# EAGLE design development (EAGLE 6.3)
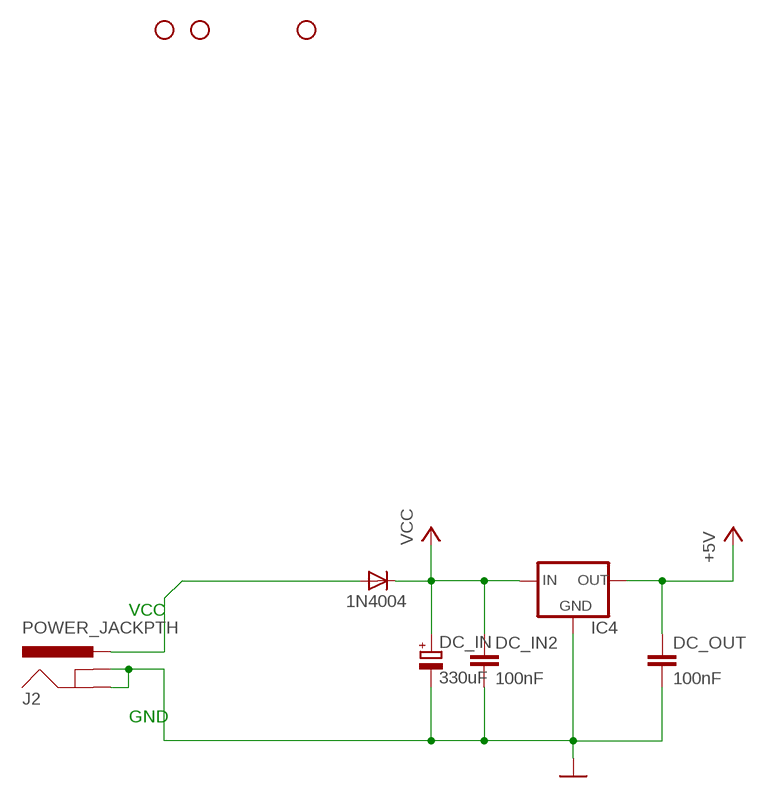
[diagram p0: schematic, sheet 1, part 1 of 2]
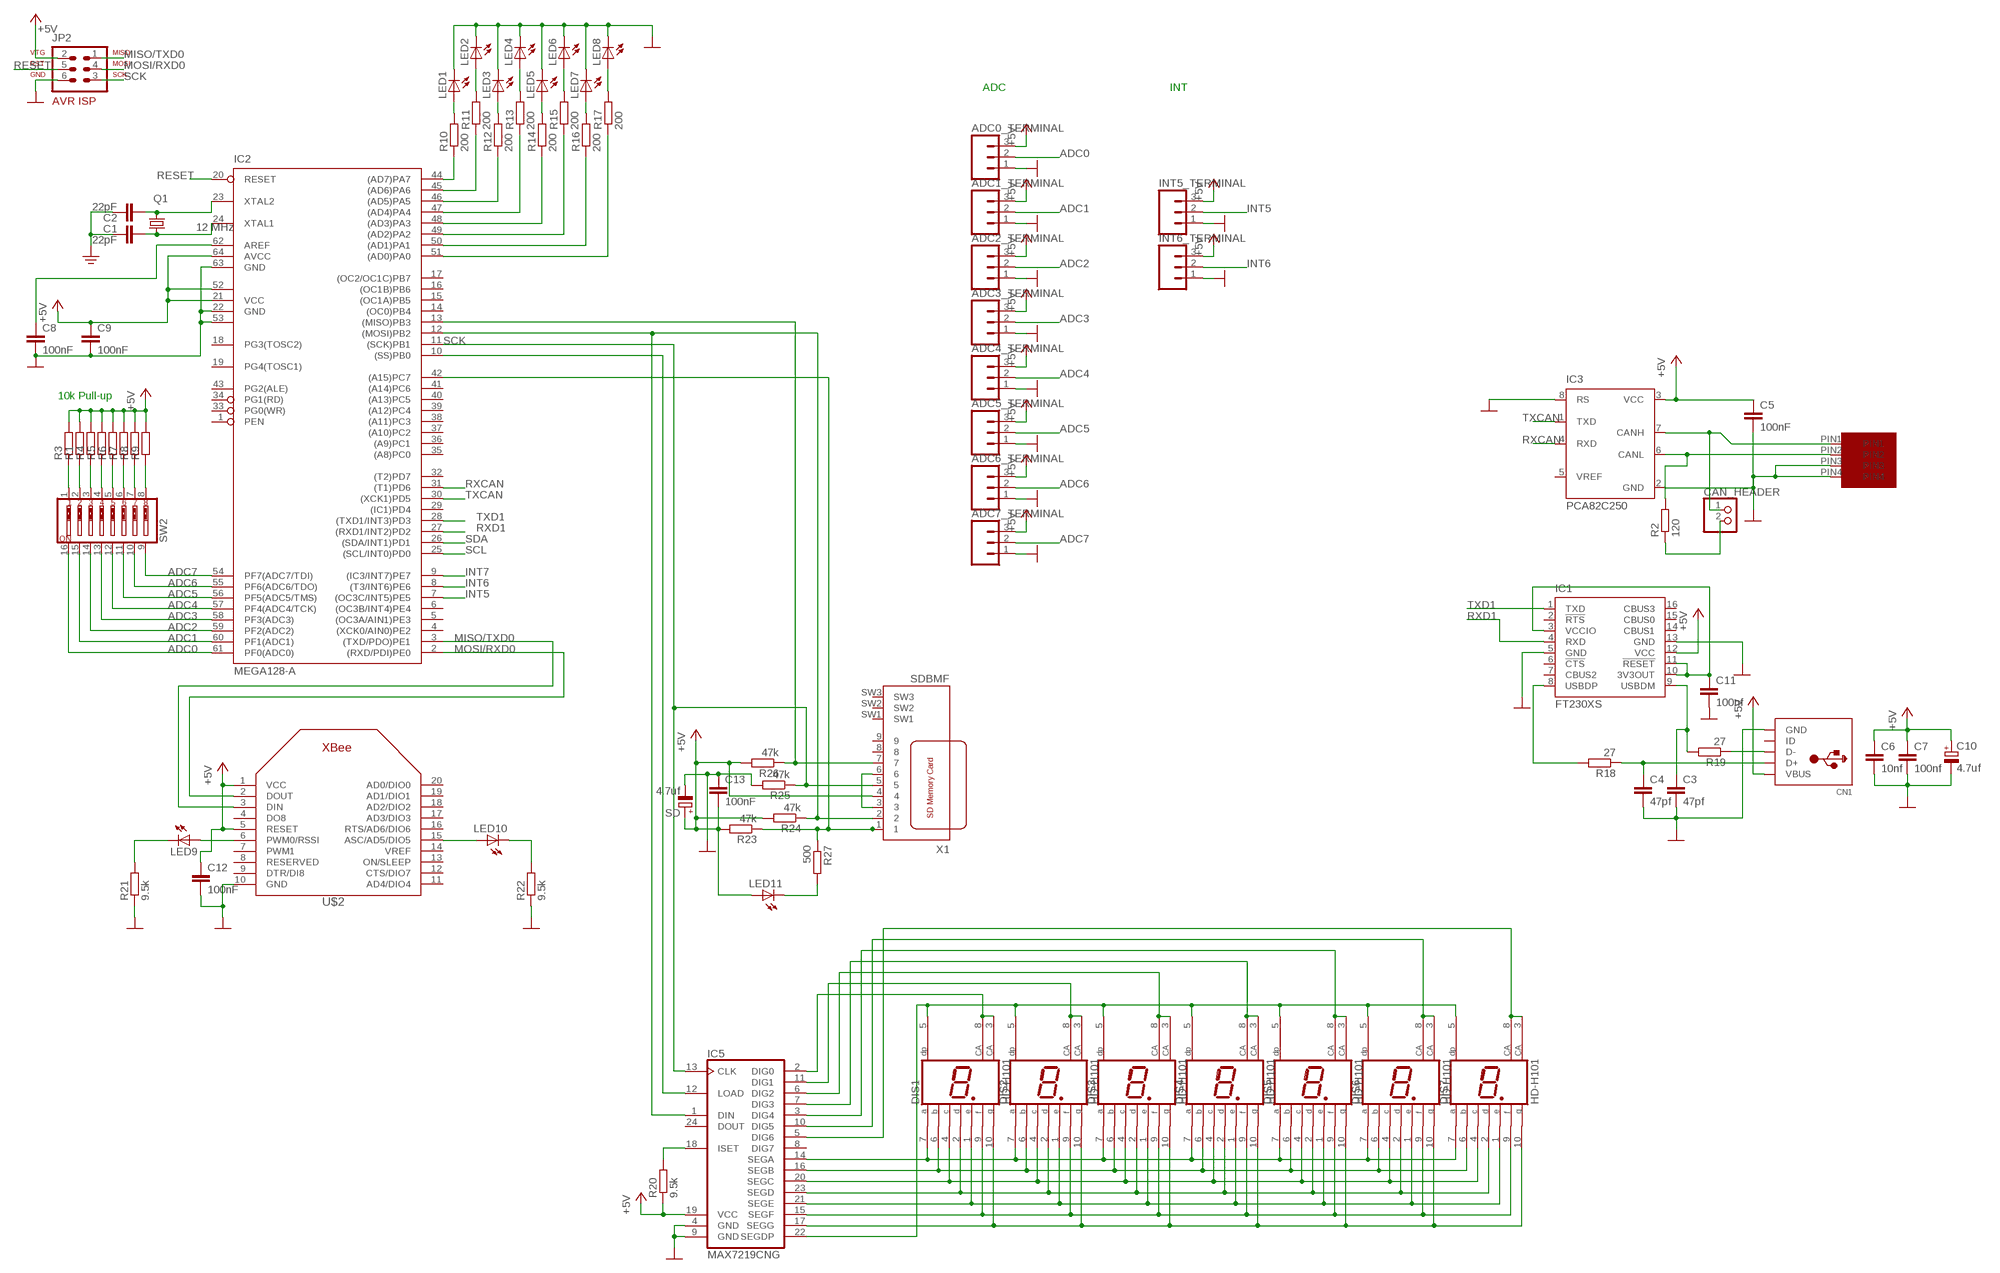
[diagram p1: schematic, sheet 1, part 2 of 2]

## Parts
ADC0_TERMINAL  M03SCREW  [SCREWTERMINAL-3.5MM-3]
ADC1_TERMINAL  M03SCREW  [SCREWTERMINAL-3.5MM-3]
ADC2_TERMINAL  M03SCREW  [SCREWTERMINAL-3.5MM-3]
ADC3_TERMINAL  M03SCREW  [SCREWTERMINAL-3.5MM-3]
ADC4_TERMINAL  M03SCREW  [SCREWTERMINAL-3.5MM-3]
ADC5_TERMINAL  M03SCREW  [SCREWTERMINAL-3.5MM-3]
ADC6_TERMINAL  M03SCREW  [SCREWTERMINAL-3.5MM-3]
ADC7_TERMINAL  M03SCREW  [SCREWTERMINAL-3.5MM-3]
C1  22pF  C5/2.5  [C5B2.5]
C2  22pF  C5/2.5  [C5B2.5]
C3  47pf  C-EU050-025X075  [C050-025X075]
C4  47pf  C-EU050-025X075  [C050-025X075]
C5  100nF  C-EU050-024X044  [C050-024X044]
C6  10nf  C-EU050-025X075  [C050-025X075]
C7  100nf  C-EU050-025X075  [C050-025X075]
C8  100nF  C-EU050-024X044  [C050-024X044]
C9  100nF  C-EU050-024X044  [C050-024X044]
C10  4.7uf  CPOL-EUE2.5-7  [E2,5-7]
C11  100nf  C-EU050-025X075  [C050-025X075]
C12  100nF  C-EU050-024X044  [C050-024X044]
C13  100nF  C-EU050-024X044  [C050-024X044]
CAN_HEADER  PINHD-1X2  [1X02]
CN1  USBMINIB  [USB-MINIB]
DC_IN  330uF  CPOL-EUE15-5AXIAL  [E15-5]
DC_IN2  100nF  C-EU050-024X044  [C050-024X044]
DC_OUT  100nF  C-EU050-024X044  [C050-024X044]
DIS1  HD-H101  [HDSP-M]
DIS2  HD-H101  [HDSP-M]
DIS3  HD-H101  [HDSP-M]
DIS4  HD-H101  [HDSP-M]
DIS5  HD-H101  [HDSP-M]
DIS6  HD-H101  [HDSP-M]
DIS7  HD-H101  [HDSP-M]
ENSRET  1N4004  [DO41-10]
IC1  FT230XS  [SSOP16]
IC2  MEGA128-A  [TQFP64]
IC3  PCA82C250  [DIL08]
IC4  V_REG_78XXSIDE  [78XXL]
IC5  MAX7219CNG  [DIL24-3]
INT5_TERMINAL  M03SCREW  [SCREWTERMINAL-3.5MM-3]
INT6_TERMINAL  M03SCREW  [SCREWTERMINAL-3.5MM-3]
J2  POWER_JACKPTH  [POWER_JACK_PTH]
JP2  AVR-ISP-6  [AVR-ISP-6]
JP3  STAND-OFF  [STAND-OFF]
JP4  STAND-OFF  [STAND-OFF]
JP6  STAND-OFF  [STAND-OFF]
LED1  LED3MM  [LED3MM]
LED2  LED3MM  [LED3MM]
LED3  LED3MM  [LED3MM]
LED4  LED3MM  [LED3MM]
LED5  LED3MM  [LED3MM]
LED6  LED3MM  [LED3MM]
LED7  LED3MM  [LED3MM]
LED8  LED3MM  [LED3MM]
LED9  LED5MM  [LED5MM]
LED10  LED5MM  [LED5MM]
LED11  LED5MM  [LED5MM]
Q1  12 MHz  CRYSTALHC49U70  [HC49U70]
R1  R-EU_R0603  [R0603]
R2  120  R-EU_R0603  [R0603]
R3  R-EU_R0603  [R0603]
R4  R-EU_R0603  [R0603]
R5  R-EU_R0603  [R0603]
R6  R-EU_R0603  [R0603]
R7  R-EU_R0603  [R0603]
R8  R-EU_R0603  [R0603]
R9  R-EU_R0603  [R0603]
R10  200  R-EU_R0603  [R0603]
R11  200  R-EU_R0603  [R0603]
R12  200  R-EU_R0603  [R0603]
R13  200  R-EU_R0603  [R0603]
R14  200  R-EU_R0603  [R0603]
R15  200  R-EU_R0603  [R0603]
R16  200  R-EU_R0603  [R0603]
R17  200  R-EU_R0603  [R0603]
R18  27  R-EU_R0603  [R0603]
R19  27  R-EU_R0603  [R0603]
R20  9.5k  R-EU_0204/7  [0204/7]
R21  9.5k  R-EU_0204/7  [0204/7]
R22  9.5k  R-EU_0204/7  [0204/7]
R23  47k  R-EU_0204/7  [0204/7]
R24  47k  R-EU_0204/7  [0204/7]
R25  47k  R-EU_0204/7  [0204/7]
R26  47k  R-EU_0204/7  [0204/7]
R27  500  R-EU_0204/7  [0204/7]
SD  4.7uf  CPOL-EUE15-5AXIAL  [E15-5]
SW2  SW_DIP-8  [DIPSWITCH-08]
U$1  MICROFIT4  [MICROFIT4SOCK]
U$2  XBEE  [XBEE]
X1  SDBMF  [SDBMF-009XXBXX2]

## Nets
+5V: ADC0_TERMINAL.3 ADC1_TERMINAL.3 ADC2_TERMINAL.3 ADC3_TERMINAL.3 ADC4_TERMINAL.3 ADC5_TERMINAL.3 ADC6_TERMINAL.3 ADC7_TERMINAL.3 C5.1 C6.1 C7.1 C9.1 C10.+ C13.2 CN1.VBUS DC_OUT.1 IC1.12(VCC) IC2.21(VCC) IC2.52(VCC1) IC2.64(AVCC) IC3.3(VCC) IC4.OUT IC5.19(VCC) INT5_TERMINAL.3 INT6_TERMINAL.3 JP2.2 LED11.A R1.2 R3.2 R4.2 R5.2 R6.2 R7.2 R8.2 R9.2 R20.1 R23.2 R24.2 R26.2 SD.+ X1.4
ADC0: ADC0_TERMINAL.2 IC2.61(PF0(ADC0)) SW2.16
ADC1: ADC1_TERMINAL.2 IC2.60(PF1(ADC1)) SW2.15
ADC2: ADC2_TERMINAL.2 IC2.59(PF2(ADC2)) SW2.14
ADC3: ADC3_TERMINAL.2 IC2.58(PF3(ADC3)) SW2.13
ADC4: ADC4_TERMINAL.2 IC2.57(PF4(ADC4/TCK)) SW2.12
ADC5: ADC5_TERMINAL.2 IC2.56(PF5(ADC5/TMS)) SW2.11
ADC6: ADC6_TERMINAL.2 IC2.55(PF6(ADC6/TDO)) SW2.10
ADC7: ADC7_TERMINAL.2 IC2.54(PF7(ADC7/TDI)) SW2.9
CANJUMP1: CAN_HEADER.1 IC3.7(CANH) U$1.PIN1
CANJUMP2: CAN_HEADER.2 R2.1
INT5: IC2.7((OC3C/INT5)PE5) INT5_TERMINAL.2
INT6: IC2.8((T3/INT6)PE6) INT6_TERMINAL.2
INT7: IC2.9((IC3/INT7)PE7)
MISO/TXD0: IC2.3((TXD/PDO)PE1) JP2.1 U$2.3(DIN)
MOSI/RXD0: IC2.2((RXD/PDI)PE0) JP2.4 U$2.2(DOUT)
N$1: C1.2 IC2.24(XTAL1) Q1.1
N$2: C2.2 IC2.23(XTAL2) Q1.2
N$3: R1.1 SW2.2
N$4: R3.1 SW2.1
N$5: ENSRET.A J2.PWR
N$6: IC2.44((AD7)PA7) R10.1
N$7: R4.1 SW2.3
N$8: LED1.A R10.2
N$9: IC2.45((AD6)PA6) R11.1
N$10: C8.1 IC2.62(AREF)
N$11: LED2.A R11.2
N$12: IC2.46((AD5)PA5) R12.1
N$13: LED3.A R12.2
N$14: R5.1 SW2.4
N$15: R6.1 SW2.5
N$16: R7.1 SW2.6
N$17: R8.1 SW2.7
N$18: IC2.47((AD4)PA4) R13.1
N$19: LED4.A R13.2
N$20: R9.1 SW2.8
N$21: IC2.48((AD3)PA3) R14.1
N$22: LED5.A R14.2
N$23: IC2.49((AD2)PA2) R15.1
N$24: IC2.50((AD1)PA1) R16.1
N$25: LED6.A R15.2
N$26: LED7.A R16.2
N$27: IC2.51((AD0)PA0) R17.1
N$28: LED8.A R17.2
N$29: C3.1 IC1.9(USBDM) R19.2
N$30: IC1.8(USBDP) R18.2
N$31: C4.1 CN1.D+ R18.1
N$32: CN1.D- R19.1
N$33: DIS1.7(A) DIS2.7(A) DIS3.7(A) DIS4.7(A) DIS5.7(A) DIS6.7(A) DIS7.7(A) IC5.14(SEGA)
N$34: DIS1.6(B) DIS2.6(B) DIS3.6(B) DIS4.6(B) DIS5.6(B) DIS6.6(B) DIS7.6(B) IC5.16(SEGB)
N$35: DIS1.4(C) DIS2.4(C) DIS3.4(C) DIS4.4(C) DIS5.4(C) DIS6.4(C) DIS7.4(C) IC5.20(SEGC)
N$36: C11.1 IC1.3(VCCIO) IC1.10(3V3OUT) IC1.11(!RESET)
N$37: DIS1.2(D) DIS2.2(D) DIS3.2(D) DIS4.2(D) DIS5.2(D) DIS6.2(D) DIS7.2(D) IC5.23(SEGD)
N$38: DIS1.1(E) DIS2.1(E) DIS3.1(E) DIS4.1(E) DIS5.1(E) DIS6.1(E) DIS7.1(E) IC5.21(SEGE)
N$39: DIS1.9(F) DIS2.9(F) DIS3.9(F) DIS4.9(F) DIS5.9(F) DIS6.9(F) DIS7.9(F) IC5.15(SEGF)
N$40: DIS1.10(G) DIS2.10(G) DIS3.10(G) DIS4.10(G) DIS5.10(G) DIS6.10(G) DIS7.10(G) IC5.17(SEGG)
N$41: DIS1.5(DP) DIS2.5(DP) DIS3.5(DP) DIS4.5(DP) DIS5.5(DP) DIS6.5(DP) DIS7.5(DP) IC5.22(SEGDP)
N$42: DIS1.3(CA) DIS1.8(CA) IC5.2(DIG0)
N$43: DIS2.3(CA) DIS2.8(CA) IC5.11(DIG1)
N$44: DIS3.3(CA) DIS3.8(CA) IC5.6(DIG2)
N$45: DIS4.3(CA) DIS4.8(CA) IC5.7(DIG3)
N$46: DIS5.3(CA) DIS5.8(CA) IC5.3(DIG4)
N$47: DIS6.3(CA) DIS6.8(CA) IC5.10(DIG5)
N$48: DIS7.3(CA) DIS7.8(CA) IC5.5(DIG6)
N$49: LED9.K(C) R21.2
N$50: IC5.18(ISET) R20.2
N$51: IC3.6(CANL) R2.2 U$1.PIN2
N$52: LED9.A U$2.6(PWM0/RSSI)
N$53: IC2.10((SS)PB0) IC5.12(LOAD)
N$55: LED10.A U$2.15(ASC/AD5/DIO5)
N$56: LED10.K(C) R22.2
N$57: X1.3 X1.6
N$59: IC2.42((A15)PC7) R23.1 R27.1 X1.1
N$60: IC2.12((MOSI)PB2) IC5.1(DIN) R24.1 X1.2
N$62: IC2.13((MISO)PB3) R26.1 X1.7
N$63: LED11.K(C) R27.2
PE: ADC0_TERMINAL.1 ADC1_TERMINAL.1 ADC2_TERMINAL.1 ADC3_TERMINAL.1 ADC4_TERMINAL.1 ADC5_TERMINAL.1 ADC6_TERMINAL.1 ADC7_TERMINAL.1 C1.1 C2.1 C3.2 C4.2 C5.2 C6.2 C7.2 C8.2 C9.2 C10.- C11.2 C12.2 C13.1 CN1.GND DC_IN2.2 DC_IN.- DC_OUT.2 IC1.5(GND) IC1.13(GND) IC2.22(GND) IC2.53(GND1) IC2.63(GND) IC3.2(GND) IC3.8(RS) IC4.GND IC5.4(GND) IC5.9(GND) INT5_TERMINAL.1 INT6_TERMINAL.1 J2.GND J2.GNDBREAK JP2.6 LED1.K(C) LED2.K(C) LED3.K(C) LED4.K(C) LED5.K(C) LED6.K(C) LED7.K(C) LED8.K(C) R21.1 R22.1 R25.2 SD.- U$1.PIN3 U$1.PIN4 U$2.10(GND) ; supply symbol labelled GND
RESET: IC2.20(RESET) JP2.5
RXCAN: IC2.31((T1)PD6) IC3.4(RXD)
RXD1: IC1.4(RXD) IC2.27((RXD1/INT2)PD2)
SCK: IC2.11((SCK)PB1) IC5.13(CLK) JP2.3 R25.1 X1.5
SCL: IC2.25((SCL/INT0)PD0)
SDA: IC2.26((SDA/INT1)PD1)
TXCAN: IC2.30((XCK1)PD5) IC3.1(TXD)
TXD1: IC1.1(TXD) IC2.28((TXD1/INT3)PD3)
VCC: C12.1 DC_IN2.1 DC_IN.+ ENSRET.C IC4.IN U$2.1(VCC) U$2.5(RESET) ; supply symbol labelled +5V
Unconnected: CN1.ID IC1.2(!RTS) IC1.6(!CTS) IC1.7(CBUS2) IC1.14(CBUS1) IC1.15(CBUS0) IC1.16(CBUS3) IC2.1(PEN) IC2.4((XCK0/AIN0)PE2) IC2.5((OC3A/AIN1)PE3) IC2.6((OC3B/INT4)PE4) IC2.14((OC0)PB4) IC2.15((OC1A)PB5) IC2.16((OC1B)PB6) IC2.17((OC2/OC1C)PB7) IC2.18(PG3(TOSC2)) IC2.19(PG4(TOSC1)) IC2.29((IC1)PD4) IC2.32((T2)PD7) IC2.33(PG0(WR)) IC2.34(PG1(RD)) IC2.35((A8)PC0) IC2.36((A9)PC1) IC2.37((A10)PC2) IC2.38((A11)PC3) IC2.39((A12)PC4) IC2.40((A13)PC5) IC2.41((A14)PC6) IC2.43(PG2(ALE)) IC3.5(VREF) IC5.8(DIG7) IC5.24(DOUT) U$2.4(DO8) U$2.7(PWM1) U$2.8(RESERVED) U$2.9(DTR/DI8) U$2.11(AD4/DIO4) U$2.12(CTS/DIO7) U$2.13(ON/SLEEP) U$2.14(VREF) U$2.16(RTS/AD6/DIO6) U$2.17(AD3/DIO3) U$2.18(AD2/DIO2) U$2.19(AD1/DIO1) U$2.20(AD0/DIO0) X1.8 X1.9 X1.SW1 X1.SW2 X1.SW3

## Notes on the sheet
- ADC | INT
- 10k Pull-up
- VCC
- GND

## Library data of the parts
ADC0_TERMINAL ADC1_TERMINAL ADC2_TERMINAL ADC3_TERMINAL ADC4_TERMINAL ADC5_TERMINAL ADC6_TERMINAL ADC7_TERMINAL INT5_TERMINAL INT6_TERMINAL = SparkFun:M03: Header 3 Standard 3-pin 0.1" header. Use with straight break away headers (SKU : PRT-00116), right angle break away headers (PRT-00553), swiss pins (PRT-00743), machine pins (PRT-00117), and female headers (PRT-00115). Molex polarized connector foot print use with SKU : PRT-08232 with associated crimp pins and housings.
C1 C2 = capacitor-wima:C: CAPACITOR naming: grid - package width
C3-C9 C11-C13 DC_IN2 DC_OUT = rcl:C-EU: CAPACITOR, European symbol
C10 DC_IN SD = rcl:CPOL-EU: POLARIZED CAPACITOR, European symbol
CAN_HEADER = pinhead:PINHD-1X2: PIN HEADER
CN1 = adafruit:USB: USB Connectors USBMINIB - Surface Mount Female Mini-B USB Connector 4UConnector: 06564 By microbuilder.eu Thru-hole RA Female Mini-B USB Connector 4UConnector: 18732 By ladyada.net
DIS1-DIS7 = display-hp:HD-H101: LED DISPLAY 1-character 7 segment, decimal point right; OC_FARNELL: unknown; OC_NEWARK: unknown
ENSRET = diode:1N4004: DIODE general purpose rectifier, 1 A
IC1 = ftdichip:FT230X: USB to BASIC UART IC Auto generated by make-symbol-device-package-bsdl.ulp Rev. 43 Source: Data sheet <http://www.ftdichip.com/Support/Documents/DataSheets/ICs/DS_FT230X.pdf>
IC2 = atmel:MEGA128: MICROCONTROLLER 128 Kbytes FLASH 4 Kbytes SRAM 4 Kbytes EEPROM DUAL USART 8-channel 10 bit ADC Source: avr.lbr
IC3 = micro-philips:PCA82C250: CAN CONTROLLER INTERFACE
IC4 = SparkFun:V_REG_78XX: Voltage Regulator Standard 7805 5V regulator. IGO (Input Ground Output). Spark Fun Electronics SKU : COM-00107
IC5 = maxim:MAX7219CNG: LED DISPLAY DRIVER; MF: MAXIM; MPN: MAX7219CNG; OC_FARNELL: 1523914; OC_NEWARK: 34C4018
J2 = SparkFun:POWER_JACK: Power Jack This is the standard 5.5mm barrel jack for power. The PTH is the most common, proven, reliable, footprint. All others are experimental. The Slot footprint only works if the mill layer is transmitted to the PCB fab house so be warned. Spark Fun Electronics SKU : PRT-00119. Mating wall wart : TOL-00298 (and others)
JP2 = avr-5:AVR-ISP-6: AVR ISP-6 Serial Programming Header
JP3 JP4 JP6 = SparkFun:STAND-OFF: Stand Off This is the mechanical footprint for a #4 phillips button head screw. Use the keepout ring to avoid running the screw head into surrounding components. SKU : PRT-00447
LED1-LED11 = adafruit:LED: LED OSRAM: - CHIPLED LG R971, LG N971, LY N971, LG Q971, LY Q971, LO R971, LY R971 LH N974, LH R974 LS Q976, LO Q976, LY Q976 LO Q996 - Hyper CHIPLED LW Q18S LB Q993, LB Q99A, LB R99A - SideLED LS A670, LO A670, LY A670, LG A670, LP A670 LB A673, LV A673, LT A673, LW A673 LH A674 LY A675 LS A676, LA A676, LO A676, LY A676, LW A676 LS A679, LY A679, LG A679 - Hyper Micro SIDELED® LS Y876, LA Y876, LO Y876, LY Y876 LT Y87S - SmartLED LW L88C, LW L88S LB L89C, LB L89S, LG L890 LS L89K, LO L89K, LY L89K LS L896, LA L896, LO L896, LY L896 - TOPLED LS T670, LO T670, LY T670, LG T670, LP T670 LSG T670, LSP T670, LSY T670, LOP T670, LYG T670 LG T671, LOG T671, LSG T671 LB T673, LV T673, LT T673, LW T673 LH T674 LS T676, LA T676, LO T676, LY T676, LB T676, LH T676, LSB T676, LW T676 LB T67C, LV T67C, LT T67C, LS T67K, LO T67K, LY T67K, LW E67C LS E67B, LA E67B, LO E67B, LY E67B, LB E67C, LV E67C, LT E67C LW T67C LS T679, LY T679, LG T679 LS T770, LO T770, LY T770, LG T770, LP T770 LB T773, LV T773, LT T773, LW T773 LH T774 LS E675, LA E675, LY E675, LS T675 LS T776, LA T776, LO T776, LY T776, LB T776 LHGB T686 LT T68C, LB T68C - Hyper Mini TOPLED® LB M676 - Mini TOPLED Santana® LG M470 LS M47K, LO M47K, LY M47K Source: http://www.osram.convergy.de/
Q1 = crystal:CRYSTAL: CRYSTAL
R1-R27 = resistor:R-EU_: RESISTOR, European symbol
SW2 = SparkFun:SW_DIP-8: DIP Switch 8 Position Spark Fun Electronics SKU : COM-08034
U$1 = UNICORN:MICROFIT4
U$2 = adafruit:XBEE
X1 = farnell:SDBMF: SD MEMORY CARD PUSH-PUSH WITH CONNECTOR TYPE B (BIG SWUÌTCH #3) KINGFONT PRECISION INDUSTIAL CO., LTD Source: http://www.farnell.com/datasheets/74273.pdf Best.-Nr.: 9186174 Hersteller: MULTICOMP Herstellerbez.: SDBMF-00915B0T2

## Board
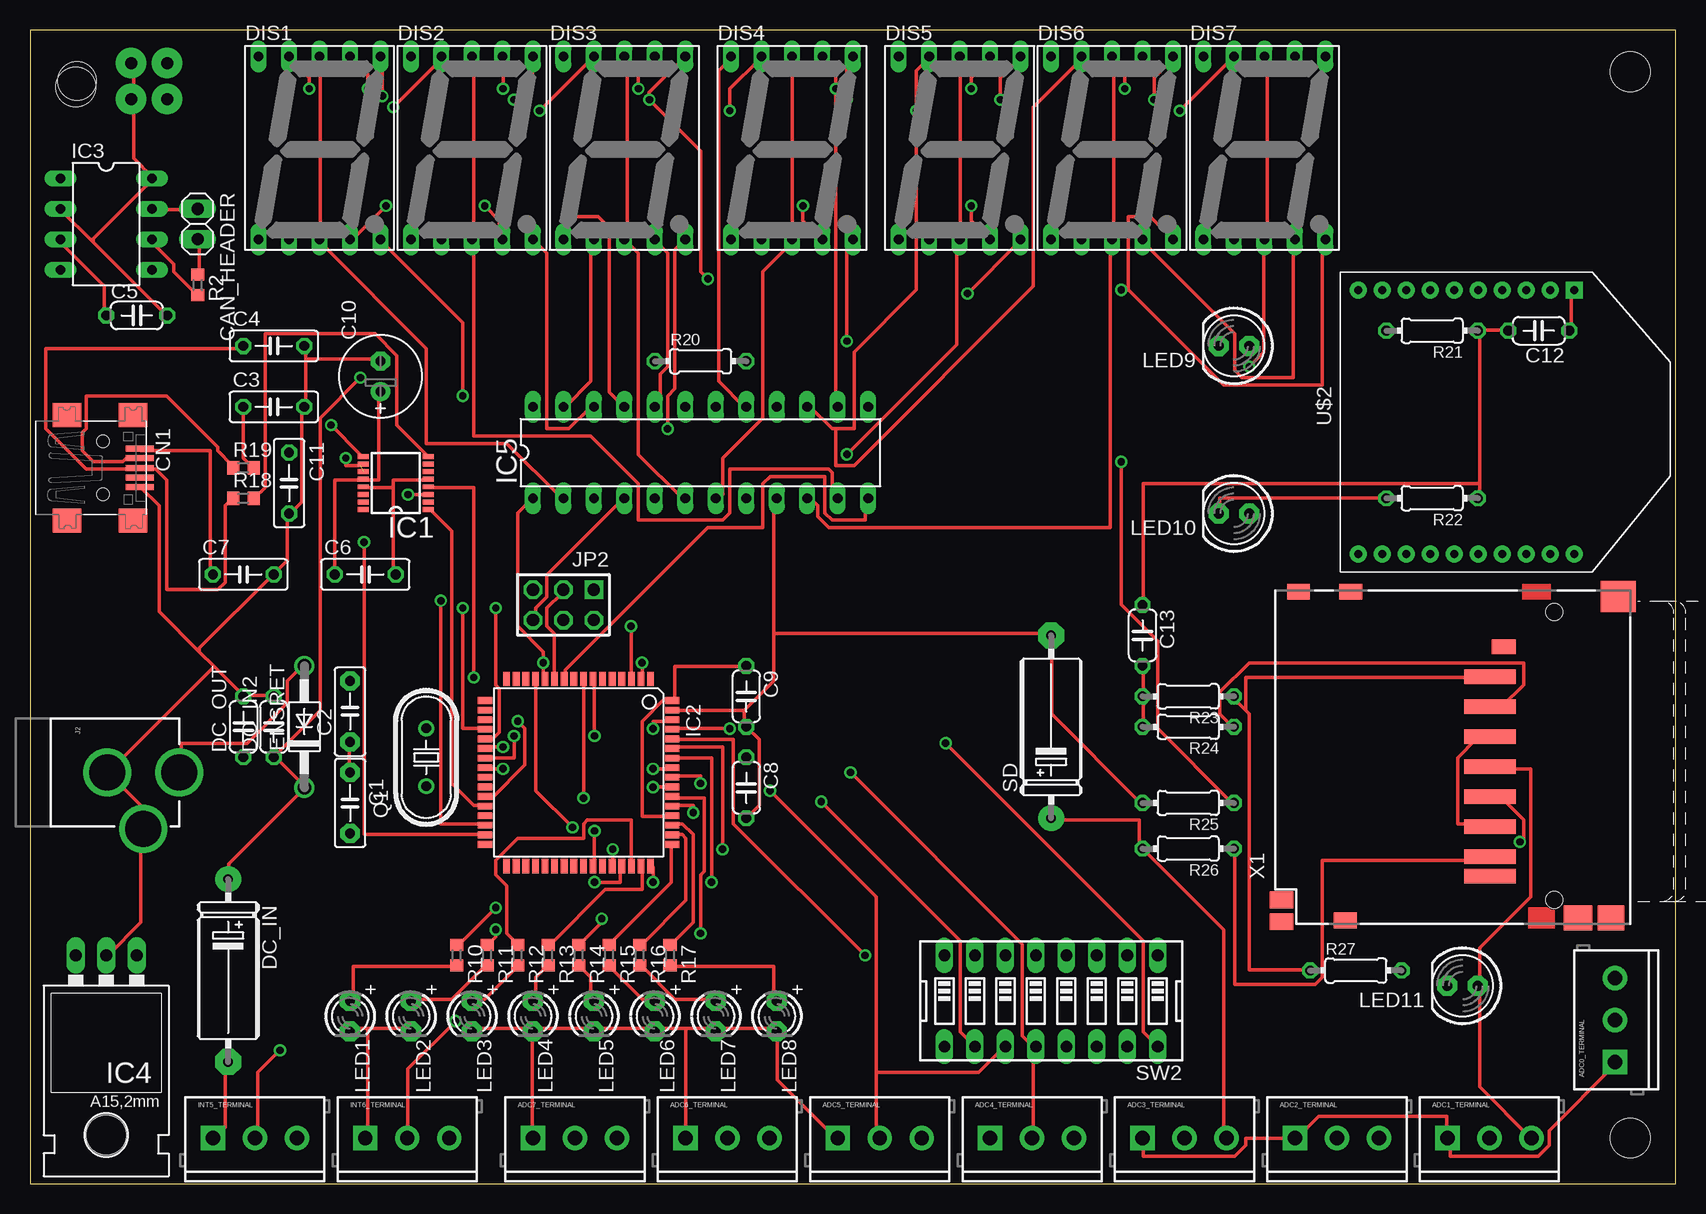
[diagram p2: board, top side]
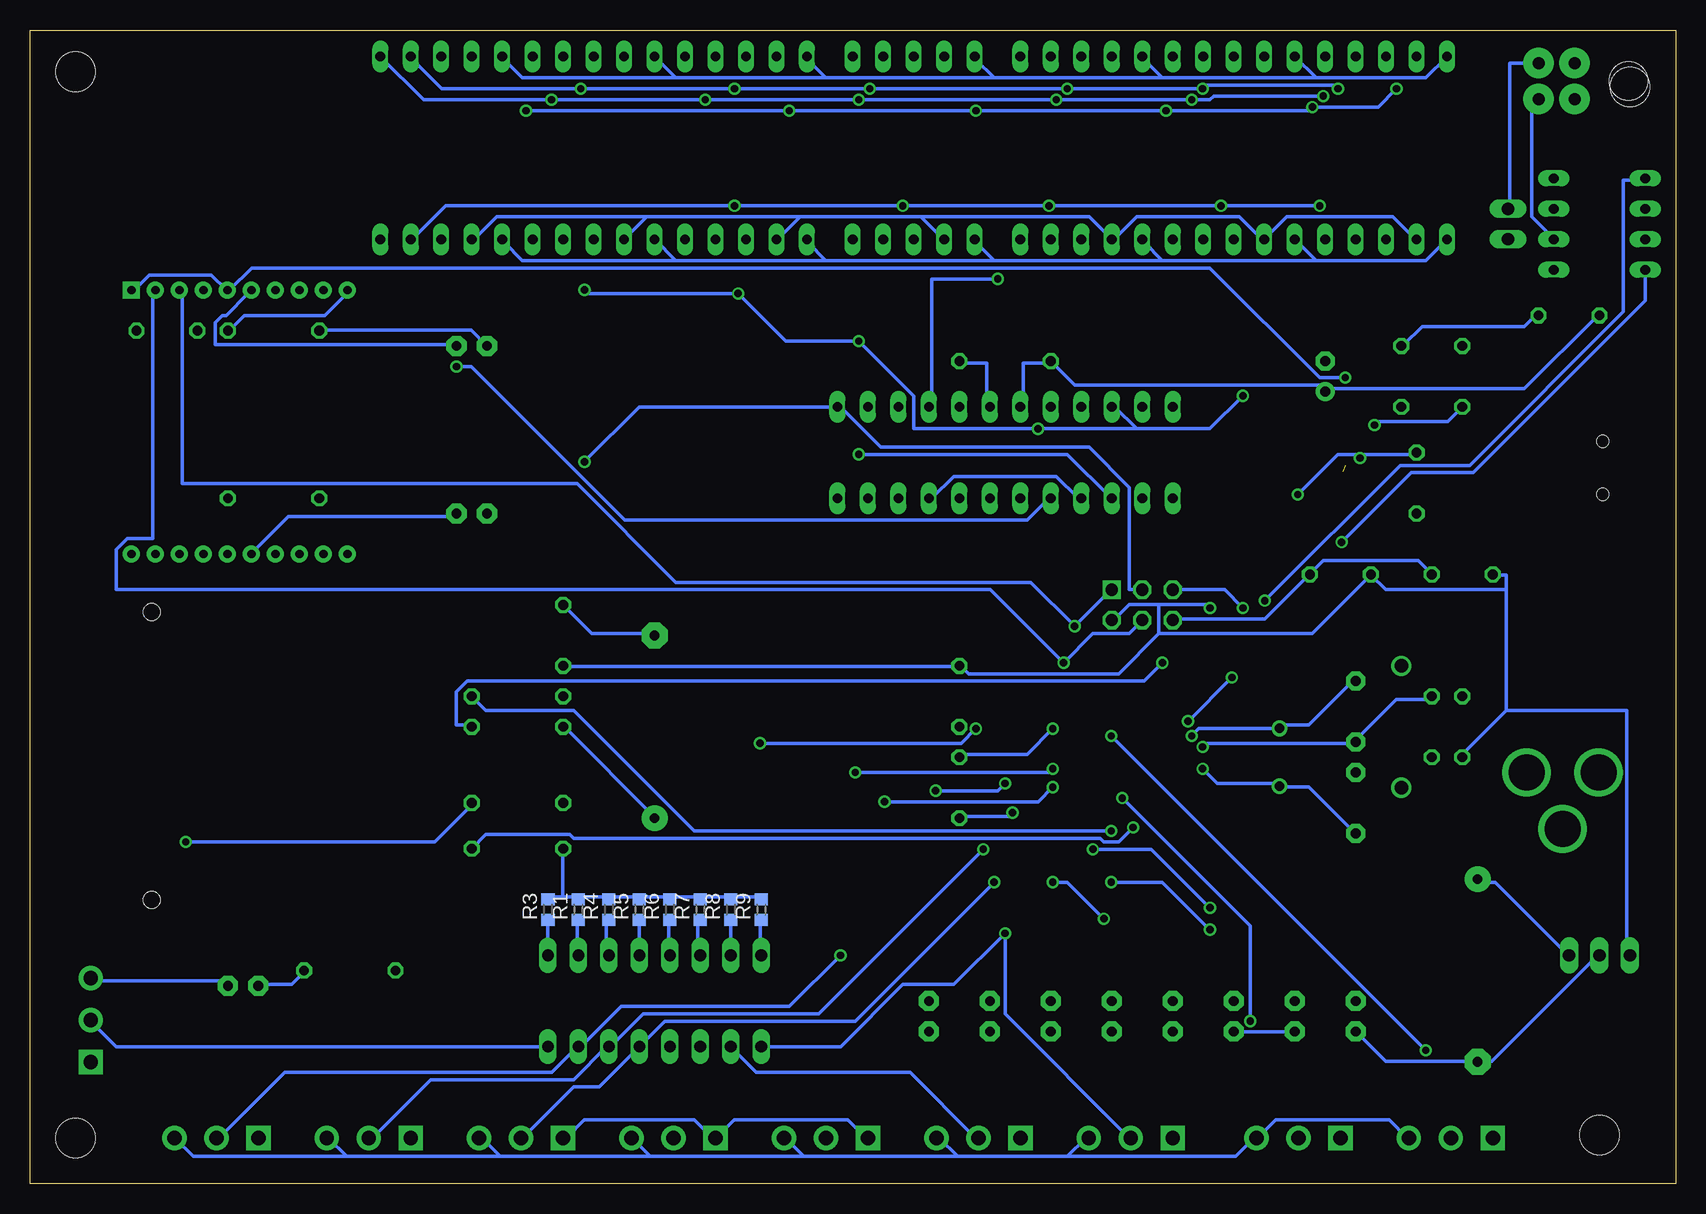
[diagram p3: board, bottom side, seen from below]

Size 137.14 x 96.19 mm. Coordinates in mm from the lower left corner, seen from the top.
Outline: 0,0 137.14,0 137.14,96.19 0,96.19 0,0
Copper layers (1*16): Top 0.035mm / dielectric 1.5mm / Bottom 0.035mm
Design rules "default *": minimum track width 12mil, minimum drill 24mil, track to track 8mil, track to pad 8mil, pad to pad 8mil, via to via 8mil, smd to smd 8mil, copper to edge 40mil, drill to drill 8mil, minimum pad ring 10mil, minimum via ring 8mil, stop-mask expansion 4mil, vias tented up to drill 0mil, thermal gap 10mil

### Footprints (pad centres in the part's own frame; a part is rotated, then mirrored left to right if it is on the bottom)
SCREWTERMINAL-3.5MM-3 = drill 1.2 pad 2.032 square: 1 0,0 | drill 1.2 pad 2.032: 2 3.5,0; 3 7,0
C5B2.5 = drill 0.813 pad 1.6 octagon: 1 -2.54,0; 2 2.54,0
C050-025X075 = drill 0.813 octagon: 1 -2.54,0; 2 2.54,0
C050-024X044 = drill 0.813 octagon: 1 -2.54,0; 2 2.54,0
E2,5-7 = drill 0.813 pad 1.6: + -1.27,0 | drill 0.813 pad 1.6 octagon: - 1.27,0
1X02 = drill 1.016 long: 1 -1.27,0; 2 1.27,0
USB-MINIB = smd 0.5 x 2.308: D+ 0,4.064; D- -0.8,4.064; GND 1.6,4.064; ID 0.8,4.064; VBUS -1.6,4.064 | smd 2 x 2.4: GND1 -4.4,-2; GND2 -4.4,3.5; GND3 4.4,3.5; GND4 4.4,-2 | hole 1: -2.2,1; 2.2,1
E15-5 = drill 0.813 pad 2.159: + -7.62,0 | drill 0.813 pad 2.159 octagon: - 7.62,0
HDSP-M = drill 0.813 long: 1 -5.08,-7.62; 2 -2.54,-7.62; 3 0,-7.62; 4 2.54,-7.62; 5 5.08,-7.62; 6 5.08,7.62; 7 2.54,7.62; 8 0,7.62; 9 -2.54,7.62; 10 -5.08,7.62
DO41-10 = drill 1.118: A 5.08,0; C -5.08,0
SSOP16 = smd 0.914 x 0.406: 1 -2.718,2.223; 2 -2.718,1.587; 3 -2.718,0.953; 4 -2.718,0.318; 5 -2.718,-0.318; 6 -2.718,-0.953; 7 -2.718,-1.587; 8 -2.718,-2.223; 9 2.718,-2.223; 10 2.718,-1.587; 11 2.718,-0.953; 12 2.718,-0.318; 13 2.718,0.318; 14 2.718,0.953; 15 2.718,1.587; 16 2.718,2.223
TQFP64 = smd 1.194 x 0.559: 1 -7.8,6; 2 -7.8,5.2; 3 -7.8,4.4; 4 -7.8,3.6; 5 -7.8,2.8; 6 -7.8,2; 7 -7.8,1.2; 8 -7.8,0.4; 9 -7.8,-0.4; 10 -7.8,-1.2; 11 -7.8,-2; 12 -7.8,-2.8; 13 -7.8,-3.6; 14 -7.8,-4.4; 15 -7.8,-5.2; 16 -7.8,-6; 33 7.8,-6; 34 7.8,-5.2; 35 7.8,-4.4; 36 7.8,-3.6; 37 7.8,-2.8; 38 7.8,-2; 39 7.8,-1.2; 40 7.8,-0.4; 41 7.8,0.4; 42 7.8,1.2; 43 7.8,2; 44 7.8,2.8; 45 7.8,3.6; 46 7.8,4.4; 47 7.8,5.2; 48 7.8,6 | smd 0.559 x 1.194: 17 -6,-7.8; 18 -5.2,-7.8; 19 -4.4,-7.8; 20 -3.6,-7.8; 21 -2.8,-7.8; 22 -2,-7.8; 23 -1.2,-7.8; 24 -0.4,-7.8; 25 0.4,-7.8; 26 1.2,-7.8; 27 2,-7.8; 28 2.8,-7.8; 29 3.6,-7.8; 30 4.4,-7.8; 31 5.2,-7.8; 32 6,-7.8; 49 6,7.8; 50 5.2,7.8; 51 4.4,7.8; 52 3.6,7.8; 53 2.8,7.8; 54 2,7.8; 55 1.2,7.8; 56 0.4,7.8; 57 -0.4,7.8; 58 -1.2,7.8; 59 -2,7.8; 60 -2.8,7.8; 61 -3.6,7.8; 62 -4.4,7.8; 63 -5.2,7.8; 64 -6,7.8
DIL08 = drill 0.813 long: 1 -3.81,-3.81; 2 -1.27,-3.81; 3 1.27,-3.81; 4 3.81,-3.81; 5 3.81,3.81; 6 1.27,3.81; 7 -1.27,3.81; 8 -3.81,3.81
78XXL = drill 1.016 long: GND 0,-3.81; IN -2.54,-3.81; OUT 2.54,-3.81 | hole 3.302: 0,11.176
DIL24-3 = drill 0.813 long: 1 -13.97,-3.81; 2 -11.43,-3.81; 3 -8.89,-3.81; 4 -6.35,-3.81; 5 -3.81,-3.81; 6 -1.27,-3.81; 7 1.27,-3.81; 8 3.81,-3.81; 9 6.35,-3.81; 10 8.89,-3.81; 11 11.43,-3.81; 12 13.97,-3.81; 13 13.97,3.81; 14 11.43,3.81; 15 8.89,3.81; 16 6.35,3.81; 17 3.81,3.81; 18 1.27,3.81; 19 -1.27,3.81; 20 -3.81,3.81; 21 -6.35,3.81; 22 -8.89,3.81; 23 -11.43,3.81; 24 -13.97,3.81
POWER_JACK_PTH = drill 2.997: GND 0,7.7; GNDBREAK 4.7,10.7; PWR 0,13.7
AVR-ISP-6 = drill 1.016 square: 1 -2.54,-1.27 | drill 1.016 octagon: 2 -2.54,1.27; 3 0,-1.27; 4 0,1.27; 5 2.54,-1.27; 6 2.54,1.27
STAND-OFF = hole 3.302: 0,0
LED3MM = drill 0.813 pad 1.676 octagon: A -1.27,0; K 1.27,0
LED5MM = drill 0.813 pad 1.676 octagon: A -1.27,0; K 1.27,0
HC49U70 = drill 0.813: 1 -2.413,0; 2 2.413,0
R0603 = smd 1 x 1.1: 1 -0.85,0; 2 0.85,0
0204/7 = drill 0.813 octagon: 1 -3.81,0; 2 3.81,0
DIPSWITCH-08 = drill 0.97 long: 1 -8.89,-3.81; 2 -6.35,-3.81; 3 -3.81,-3.81; 4 -1.27,-3.81; 5 1.27,-3.81; 6 3.81,-3.81; 7 6.35,-3.81; 8 8.89,-3.81; 9 8.89,3.81; 10 6.35,3.81; 11 3.81,3.81; 12 1.27,3.81; 13 -1.27,3.81; 14 -3.81,3.81; 15 -6.35,3.81; 16 -8.89,3.81
MICROFIT4SOCK = drill 1 pad 2.54: PIN1 -2,0; PIN2 1,0; PIN3 -2,-3; PIN4 1,-3 | hole 3.2: -0.5,-7.5
XBEE = drill 0.7 pad 1.422 square: 1 -11,5.5 | drill 0.7 pad 1.422: 2 -11,3.5; 3 -11,1.5; 4 -11,-0.5; 5 -11,-2.5; 6 -11,-4.5; 7 -11,-6.5; 8 -11,-8.5; 9 -11,-10.5; 10 -11,-12.5; 11 11,-12.5; 12 11,-10.5; 13 11,-8.5; 14 11,-6.5; 15 11,-4.5; 16 11,-2.5; 17 11,-0.5; 18 11,1.5; 19 11,3.5; 20 11,5.5
SDBMF-009XXBXX2 = smd 1.2 x 4.3: 1 6.7,5.325; 2 4.2,5.325; 3 1.7,5.325; 4 -0.8,5.325; 5 -3.3,5.325; 6 -5.8,5.325; 7 -8.3,5.325; 8 -9.925,5.325 | smd 1.2 x 2: 9 9.2,4.175 | smd 2.1 x 2.4: M1 -13.4,-2 | smd 2.6 x 2.9: M2 13.4,-5.35 | smd 1.3 x 1.9: M3 -13.6,17.4; M4 13.8,16.95; M5 13.8,21.3 | smd 1.4 x 1.95: SW1 -11.9,22.7; SW3 -13.7,22.7 | smd 2.1 x 2.2: SW2 -13.4,-4.75 | hole 1.4: -11.9,0; 12.1,0

### Placement (x,y rotation side)
ADC0_TERMINAL  132.08,10.16 90 top
ADC1_TERMINAL  118.11,3.81 0 top
ADC2_TERMINAL  105.41,3.81 0 top
ADC3_TERMINAL  92.71,3.81 0 top
ADC4_TERMINAL  80.01,3.81 0 top
ADC5_TERMINAL  67.31,3.81 0 top
ADC6_TERMINAL  54.61,3.81 0 top
ADC7_TERMINAL  41.91,3.81 0 top
C1  26.67,31.75 270 top
C2  26.67,39.37 90 top
C3  20.32,64.77 0 top
C4  20.32,69.85 0 top
C5  8.89,72.39 0 top
C6  27.94,50.8 0 top
C7  17.78,50.8 0 top
C8  59.69,33.02 270 top
C9  59.69,40.64 270 top
C10  29.21,67.31 90 top
C11  21.59,58.42 270 top
C12  125.73,71.12 180 top
C13  92.71,45.72 270 top
CAN_HEADER  13.97,80.01 270 top
CN1  5.08,59.69 270 top
DC_IN  16.51,17.78 270 top
DC_IN2  20.32,38.1 90 top
DC_OUT  17.78,38.1 90 top
DIS1  24.13,86.36 0 top
DIS2  36.83,86.36 0 top
DIS3  49.53,86.36 0 top
DIS4  63.5,86.36 0 top
DIS5  77.47,86.36 0 top
DIS6  90.17,86.36 0 top
DIS7  102.87,86.36 0 top
ENSRET  22.86,38.1 90 top
IC1  30.48,58.42 180 top
IC2  45.72,34.29 270 top
IC3  6.35,80.01 270 top
IC4  6.35,15.24 180 top
IC5  55.88,60.96 0 top
INT5_TERMINAL  15.24,3.81 0 top
INT6_TERMINAL  27.94,3.81 0 top
J2  -1.27,34.29 270 top
JP2  44.45,48.26 180 top
JP3  133.35,3.81 0 top
JP4  133.35,92.71 0 top
JP6  3.81,91.44 0 top
LED1  26.67,13.97 270 top
LED2  31.75,13.97 270 top
LED3  36.83,13.97 270 top
LED4  41.91,13.97 270 top
LED5  46.99,13.97 270 top
LED6  52.07,13.97 270 top
LED7  57.15,13.97 270 top
LED8  62.23,13.97 270 top
LED9  100.33,69.85 180 top
LED10  100.33,55.88 180 top
LED11  119.38,16.51 180 top
Q1  33.02,35.56 90 top
R1  91.44,22.86 90 bottom
R2  13.97,74.93 270 top
R3  93.98,22.86 90 bottom
R4  88.9,22.86 90 bottom
R5  86.36,22.86 90 bottom
R6  83.82,22.86 90 bottom
R7  81.28,22.86 90 bottom
R8  78.74,22.86 90 bottom
R9  76.2,22.86 90 bottom
R10  35.56,19.05 270 top
R11  38.1,19.05 270 top
R12  40.64,19.05 270 top
R13  43.18,19.05 270 top
R14  45.72,19.05 270 top
R15  48.26,19.05 270 top
R16  50.8,19.05 270 top
R17  53.34,19.05 270 top
R18  17.78,57.15 0 top
R19  17.78,59.69 0 top
R20  55.88,68.58 0 top
R21  116.84,71.12 180 top
R22  116.84,57.15 180 top
R23  96.52,40.64 180 top
R24  96.52,38.1 180 top
R25  96.52,31.75 180 top
R26  96.52,27.94 180 top
R27  110.49,17.78 0 top
SD  85.09,38.1 90 top
SW2  85.09,15.24 180 top
U$1  11.43,91.44 270 top
U$2  123.19,63.5 270 top
X1  127,35.56 90 top

### Tracks (layer width: path | path; a pad name or v marks a point on that pad's centre or on a via)
+5V  (via drill 0.61)
  Top 0.305: IC3.3 2.54,78.49 6.2,74.83 6.2,72.39 C5.1 | C10.+ 29.06,65.99 29.06,58.67 27.84,58.67 IC1.12 27.53,58.67 25.4,58.67 C6.1 | IC2.52 53.44,30.63 51,30.63 51,38.56 52.83,40.39 53.44,40.39 IC2.64 53.75,40.39 53.75,43.13 59.54,43.13 C9.1 | v38.81,48.01 38.81,41.6 39.12,41.3 39.12,37.64 38.51,37.03 38.2,37.03 IC2.21 | CN1.VBUS 9.25,61.11 15.04,61.11 15.04,51.05 C7.1 | ADC1_TERMINAL.3 125.07,3.81 120.8,8.08 120.8,16.31 LED11.A 120.8,16.61 120.8,19.66 125.07,23.93 125.07,34.59 121.72,34.59 X1.4 | R24.2 92.76,38.25 92.76,40.39 R23.2 92.76,40.69 92.76,43.13 C13.2 | SD.+ 85.14,30.33 92.46,30.33 92.46,28.19 R26.2 99.47,21.18 99.47,3.81 ADC3_TERMINAL.3
  Bottom 0.305: IC5.19 54.36,64.77 54.36,68.43 52.22,68.43 R20.1 50.09,66.6 29.67,66.6 29.36,66.29 C10.+ 29.06,66.29 12.6,66.29 6.5,72.39 C5.1 | v38.81,48.01 39.12,48.31 43.08,48.31 | 43.08,48.31 45.52,48.31 46.74,47.09 JP2.2 | 14.12,39.47 17.78,35.81 DC_OUT.1 | 14.12,49.53 14.12,50.75 15.04,50.75 C7.1 | 14.12,49.53 14.12,39.47 | 25.4,50.75 24.18,49.53 14.12,49.53 | 14.12,39.47 4.06,39.47 4.06,19.05 IC4.OUT | 43.08,45.87 43.08,48.31 | 43.08,45.87 30.28,45.87 25.4,50.75 | 25.4,50.75 C6.1 | 43.08,45.87 46.43,42.52 58.93,42.52 59.54,43.13 C9.1 59.84,43.13 92.46,43.13 C13.2 | LED11.A 120.8,16.61 121.11,16.92 132.08,16.92 ADC0_TERMINAL.3 | 78.74,23.93 76.3,23.93 R9.2 | 86.36,23.93 83.92,23.93 R6.2 83.62,23.93 81.48,23.93 R7.2 81.18,23.93 78.74,23.93 | 78.74,23.93 R8.2 | 92.76,23.93 91.54,23.93 R1.2 91.24,23.93 89.1,23.93 R4.2 88.8,23.93 86.36,23.93 | 92.76,23.93 93.98,23.93 R3.2 | 92.76,23.93 92.76,27.89 R26.2 | R24.2 92.46,37.95 85.14,30.63 SD.+ | 86.36,23.93 R5.2 | INT5_TERMINAL.3 22.35,3.81 23.88,5.33 33.33,5.33 34.85,3.81 INT6_TERMINAL.3 35.15,3.81 36.68,2.29 50.7,2.29 | 50.7,2.29 49.17,3.81 ADC7_TERMINAL.3 | 59.84,2.29 50.7,2.29 | 59.84,2.29 61.37,3.81 ADC6_TERMINAL.3 | 72.64,2.29 74.17,3.81 ADC5_TERMINAL.3 | 59.84,2.29 72.64,2.29 | 85.45,2.29 86.97,3.81 ADC4_TERMINAL.3 | 72.64,2.29 85.45,2.29 | 97.94,2.29 99.47,3.81 ADC3_TERMINAL.3 | 85.45,2.29 97.94,2.29 | 110.74,2.29 112.27,3.81 ADC2_TERMINAL.3 | 97.94,2.29 110.74,2.29 | 110.74,2.29 123.55,2.29 125.07,3.81 ADC1_TERMINAL.3
ADC0  (via drill 0.61)
  Top 0.305: v58.32,37.95 53.75,37.95 IC2.61 | v76.3,36.73 92.76,20.27 92.76,12.65 SW2.16
  Bottom 0.305: v58.32,37.95 59.54,36.73 v76.3,36.73 | SW2.16 129.95,11.43 132.08,13.56 ADC0_TERMINAL.2
ADC1  (via drill 0.61)
  Top 0.305: v69.6,19.05 58.62,30.02 58.62,37.03 53.75,37.03 IC2.60
  Bottom 0.305: v69.6,19.05 73.86,14.78 87.88,14.78 91.24,11.43 SW2.15 91.54,11.43 93.68,9.3 115.93,9.3 121.41,3.81 ADC1_TERMINAL.2
ADC2  (via drill 0.61)
  Top 0.305: v57.71,27.89 57.71,36.42 53.75,36.42 IC2.59
  Bottom 0.305: v57.71,27.89 71.43,14.17 86.06,14.17 88.8,11.43 SW2.14 89.1,11.43 91.85,8.69 103.73,8.69 108.61,3.81 ADC2_TERMINAL.2
ADC3  (via drill 0.61)
  Top 0.305: v56.79,25.15 56.79,35.51 53.75,35.51 IC2.58
  Bottom 0.305: v56.79,25.15 68.38,13.56 84.23,13.56 SW2.13 89.71,8.08 91.85,8.08 96.11,3.81 ADC3_TERMINAL.2
ADC4  (via drill 0.61)
  Top 0.305: v51.92,34.59 53.44,34.59 IC2.57 | v68.38,34.29 82.7,19.96 82.7,12.34 83.62,11.43 | 83.62,11.43 83.62,3.81 ADC4_TERMINAL.2 | 83.62,11.43 SW2.12
  Bottom 0.305: v51.92,34.59 52.22,34.29 v68.38,34.29
ADC5  (via drill 0.61)
  Top 0.305: v55.88,33.38 55.88,33.98 53.75,33.98 IC2.56 | v61.67,32.77 70.51,23.93 70.51,9.3 | 70.51,9.3 70.51,3.81 ADC5_TERMINAL.2 | 70.51,9.3 79.05,9.3 81.18,11.43 SW2.11
  Bottom 0.305: v55.88,33.38 56.49,32.77 v61.67,32.77
ADC6  (via drill 0.61)
  Top 0.305: v51.92,33.07 53.44,33.07 IC2.55 | v65.94,31.85 77.52,20.27 77.52,12.65 SW2.10
  Bottom 0.305: v51.92,33.07 53.14,31.85 v65.94,31.85 | SW2.10 76.61,9.3 63.8,9.3 58.32,3.81 ADC6_TERMINAL.2
ADC7  (via drill 0.61)
  Top 0.305: v55.88,20.88 55.88,25.76 56.19,26.06 56.19,32.16 53.75,32.16 IC2.54
  Bottom 0.305: SW2.9 69.6,11.43 64.41,16.61 60.15,16.61 v55.88,20.88 55.88,14.17 45.52,3.81 ADC7_TERMINAL.2
CANJUMP1
  Top 0.305: IC3.7 10.16,81.23 13.82,81.23 CAN_HEADER.1
  Bottom 0.305: CAN_HEADER.1 13.82,81.53 13.82,93.42 11.68,93.42 U$1.PIN1
CANJUMP2
  Top 0.305: R2.1 14.12,76.05 14.12,78.49 CAN_HEADER.2
INT5  (via drill 0.61)
  Top 0.305: v47.04,37.34 47.04,41.91 IC2.7 | v20.83,11.12 19,9.3 19,3.81 INT5_TERMINAL.2
  Bottom 0.305: v20.83,11.12 v47.04,37.34
INT6  (via drill 0.61)
  Top 0.305: v46.13,32.16 46.13,41.91 IC2.8 | v35.46,13.56 31.5,9.6 31.5,3.81 INT6_TERMINAL.2
  Bottom 0.305: v46.13,32.16 35.46,21.49 v35.46,13.56
MISO/TXD0  (via drill 0.61)
  Top 0.305: v50.09,46.48 50.09,42.21 IC2.3
  Bottom 0.305: JP2.1 47.04,49.53 v50.09,46.48 53.75,50.14 83.31,50.14 91.54,58.37 124.46,58.37 124.46,74.22 U$2.3
MOSI/RXD0  (via drill 0.61)
  Top 0.305: v51,43.43 51,42.21 IC2.2
  Bottom 0.305: JP2.4 44.6,46.79 45.52,45.87 48.56,45.87 v51,43.43 57.1,49.53 129.95,49.53 129.95,52.88 129.03,53.8 126.9,53.8 126.9,74.22 U$2.2
N$1  (via drill 0.61)
  Top 0.305: v39.42,34.59 38.2,34.59 IC2.24
  Bottom 0.305: v39.42,34.59 38.2,33.38 33.02,33.38 Q1.1 33.02,33.07 30.58,33.07 26.92,29.41 C1.2
N$2  (via drill 0.61)
  Top 0.305: v40.34,37.34 40.34,35.51 38.2,35.51 IC2.23
  Bottom 0.305: v40.34,37.34 39.73,37.95 33.02,37.95 Q1.2 33.02,38.25 30.58,38.25 26.92,41.91 C2.2
N$3
  Bottom 0.305: R1.1 91.54,21.79 91.54,19.05 SW2.2
N$4
  Bottom 0.305: SW2.1 R3.1
N$5
  Top 0.305: ENSRET.A 22.66,43.13 21.44,41.91 21.44,40.08 18.09,36.73 12.6,36.73 12.6,34.29 J2.PWR
N$6  (via drill 0.61)
  Top 0.305: v38.81,23.01 35.76,19.96 R10.1 | v48.56,27.89 48.56,26.67 IC2.44
  Bottom 0.305: v38.81,23.01 43.69,27.89 v48.56,27.89
N$7
  Bottom 0.305: R4.1 89.1,21.79 89.1,19.05 SW2.3
N$8
  Top 0.305: R10.2 35.46,18.14 26.92,18.14 26.92,15.39 LED1.A
N$9  (via drill 0.61)
  Top 0.305: v38.81,21.18 38.81,20.57 38.2,19.96 R11.1 | v47.04,25.15 49.17,25.15 49.17,26.37 IC2.45
  Bottom 0.305: v38.81,21.18 42.77,25.15 v47.04,25.15
N$10  (via drill 0.61)
  Top 0.305: v51.92,37.95 51.92,38.56 53.44,38.56 IC2.62
  Bottom 0.305: v51.92,37.95 54.05,35.81 59.54,35.81 C8.1
N$11
  Top 0.305: R11.2 37.9,18.14 35.15,15.39 31.8,15.39 LED2.A
N$12
  Top 0.305: R12.1 40.64,19.96 39.73,20.88 39.73,24.84 38.81,25.76 38.81,26.98 40.64,28.8 46.13,28.8 46.13,30.02 46.43,30.33 50.09,30.33 50.09,26.67 IC2.46
N$13
  Top 0.305: R12.2 40.64,18.14 37.9,15.39 36.98,15.39 LED3.A
N$14
  Bottom 0.305: SW2.4 R5.1
N$15
  Bottom 0.305: R6.1 83.92,21.79 83.92,19.05 SW2.5
N$16
  Bottom 0.305: R7.1 81.48,21.79 81.48,19.05 SW2.6
N$17
  Bottom 0.305: SW2.7 R8.1
N$18
  Top 0.305: R13.1 43.38,19.96 47.95,24.54 51,24.54 51,26.37 IC2.47
N$19
  Top 0.305: R13.2 43.08,18.14 42.16,17.22 42.16,15.39 LED4.A
N$20
  Bottom 0.305: R9.1 76.3,21.79 76.3,19.05 SW2.8
N$21  (via drill 0.61)
  Top 0.305: v47.65,22.1 47.65,21.79 45.82,19.96 R14.1 | v51.92,25.15 51.92,26.37 IC2.48
  Bottom 0.305: v47.65,22.1 50.7,25.15 v51.92,25.15
N$22
  Top 0.305: R14.2 45.82,18.14 46.74,17.22 46.74,15.39 LED5.A
N$23
  Top 0.305: R15.1 48.26,19.96 53.44,25.15 53.44,28.19 IC2.49
N$24
  Top 0.305: R16.1 51,19.96 54.66,23.62 54.66,28.8 54.36,29.11 53.75,29.11 IC2.50
N$25
  Top 0.305: R15.2 48.26,18.14 51,15.39 51.92,15.39 LED6.A
N$26
  Top 0.305: R16.2 51,18.14 53.75,15.39 57.1,15.39 LED7.A
N$27
  Top 0.305: R17.1 53.44,19.96 55.27,21.79 55.27,29.11 54.36,30.02 53.75,30.02 IC2.51
N$28
  Top 0.305: R17.2 53.44,18.14 61.98,18.14 61.98,15.39 LED8.A
N$29  (via drill 0.61)
  Top 0.305: v25.09,63.25 27.53,60.81 IC1.9 | C3.1 17.78,60.5 18.39,59.89 R19.2
  Bottom 0.305: v25.09,63.25 24.79,63.55 19,63.55 C3.1
N$30
  Top 0.305: IC1.8 33.02,60.81 30.58,63.25 30.58,69.04 28.75,70.87 19.61,70.87 19.61,58.06 18.69,57.15 R18.2
N$31
  Top 0.305: R18.1 16.87,57.15 16.26,56.54 16.26,50.14 15.65,49.53 11.38,49.53 11.38,58.67 10.46,59.59 9.25,59.59 CN1.D+ 8.94,59.59 4.67,59.59 1.32,62.94 1.32,69.65 17.78,69.65 C4.1
N$32
  Top 0.305: R19.1 16.87,59.89 15.65,61.11 15.65,61.42 11.38,65.68 4.67,65.68 4.67,62.94 4.37,62.64 4.37,61.11 5.28,60.2 7.72,60.2 8.03,60.5 8.94,60.5 CN1.D-
N$33  (via drill 0.61)
  Top 0.305: DIS4.7 66.24,93.73 67.16,92.81 v67.16,91.29 67.16,64.77 IC5.14 | DIS1.7 28.14,92.51 v28.14,91.29 | v39.42,91.29 39.42,93.73 DIS2.7 | v50.7,91.29 50.7,92.51 51.92,93.73 DIS3.7 | v78.44,91.29 78.44,92.2 79.96,93.73 DIS5.7 | DIS6.7 91.24,92.51 v91.24,91.29
  Bottom 0.305: v28.14,91.29 28.45,91.59 39.12,91.59 v39.42,91.29 v50.7,91.29 v67.16,91.29 v78.44,91.29 v91.24,91.29 102.82,91.29 105.26,93.73 DIS7.7
N$34  (via drill 0.61)
  Top 0.305: v29.36,90.68 29.36,93.73 DIS1.6 | v40.34,90.37 41.86,91.9 41.86,93.73 DIS2.6 | DIS3.6 51.61,90.98 v51.61,90.37 55.88,86.11 55.88,76.05 v56.49,75.44 | v68.07,90.37 68.07,93.42 68.38,93.73 DIS4.6 | v80.87,90.37 80.87,92.2 82.4,93.73 DIS5.6 | v93.68,90.37 93.68,92.2 95.2,93.73 DIS6.6
  Bottom 0.305: v29.36,90.68 38.51,90.68 38.81,90.37 v40.34,90.37 v51.61,90.37 v68.07,90.37 v80.87,90.37 v93.68,90.37 104.34,90.37 DIS7.6 | v56.49,75.44 61.98,75.44 61.98,64.77 IC5.16
N$35  (via drill 0.61)
  Top 0.305: DIS6.4 92.76,78.49 100.38,70.87 100.38,67.82 100.99,67.21 105.26,67.21 105.26,78.49 DIS7.4 | IC5.20 52.22,64.77 52.53,65.08 52.53,67.51 53.14,68.12 53.14,77.57 52.22,78.49 DIS3.4 52.22,78.79 v52.22,81.53 | v29.67,81.53 26.92,78.79 DIS1.4 | v37.9,81.53 39.12,80.31 39.12,78.79 DIS2.4 | v64.41,81.53 64.41,80.31 65.94,78.79 DIS4.4 | DIS5.4 78.44,80.31 v78.44,81.53
  Bottom 0.305: v29.67,81.53 v37.9,81.53 v52.22,81.53 v64.41,81.53 v78.44,81.53 102.51,81.53 105.26,78.79 DIS7.4
N$36  (via drill 0.61)  (1 unrouted)
  Top 0.305: v31.5,57.45 33.02,57.45 IC1.3 | v26.31,60.5 26.31,59.89 27.53,59.89 IC1.10
  Bottom 0.305: v31.5,57.45 28.14,60.81 26.31,60.81 | 26.31,60.81 21.74,60.81 C11.1 | 26.31,60.81 v26.31,60.5
N$37
  Top 0.305: IC5.23 44.6,64.77 46.74,66.9 46.74,78.49 DIS3.2
  Bottom 0.305: DIS1.2 21.74,78.79 23.57,80.62 32.41,80.62 DIS2.2 34.54,78.79 36.37,80.62 44.91,80.62 46.74,78.79 DIS3.2 48.87,80.62 62.89,80.62 | 62.89,80.62 61.06,78.79 DIS4.2 | 72.95,80.62 62.89,80.62 | 72.95,80.62 74.78,78.79 DIS5.2 | 85.75,80.62 DIS6.2 | 72.95,80.62 85.75,80.62 | 85.75,80.62 98.25,80.62 100.08,78.79 DIS7.2
N$38
  Top 0.305: IC5.21 49.48,64.77 48.26,65.99 48.26,79.7 47.35,80.62 44.6,80.62 44.6,78.79 DIS3.1
  Bottom 0.305: DIS1.1 20.83,76.96 29.97,76.96 | DIS2.1 29.97,76.96 | 42.77,76.96 44.3,78.49 DIS3.1 | 29.97,76.96 42.77,76.96 | 56.79,76.96 58.32,78.49 DIS4.1 | 42.77,76.96 56.79,76.96 | 70.82,76.96 72.34,78.49 DIS5.1 | 56.79,76.96 70.82,76.96 | 83.31,76.96 DIS6.1 | 70.82,76.96 83.31,76.96 | 83.31,76.96 96.11,76.96 97.64,78.49 DIS7.1
N$39  (via drill 0.61)
  Top 0.305: 67.16,62.94 68.68,62.94 68.68,69.34 73.86,74.52 v73.86,89.46 73.86,92.81 74.78,93.73 DIS5.9 | 67.16,62.94 66.85,62.94 65.02,64.77 IC5.15 | 67.16,62.94 67.16,59.89 68.68,59.89 83.62,74.83 83.62,89.76 87.58,93.73 DIS6.9 | v23.27,91.29 23.27,92.2 21.74,93.73 DIS1.9 | v30.28,89.76 34.24,93.73 DIS2.9 | v42.47,89.46 DIS3.9 | v58.32,89.46 58.32,91.29 60.76,93.73 DIS4.9 | v95.81,89.46 DIS7.9
  Bottom 0.305: v23.27,91.29 24.79,89.76 v30.28,89.76 30.58,89.46 v42.47,89.46 v58.32,89.46 v73.86,89.46 v95.81,89.46
N$40
  Top 0.305: IC5.17 59.54,64.77 57.4,66.9 57.4,92.81 58.32,93.73 DIS4.10
  Bottom 0.305: DIS1.10 20.83,92.2 29.97,92.2 | DIS2.10 29.97,92.2 | 42.77,92.2 44.3,93.73 DIS3.10 | 29.97,92.2 42.77,92.2 | 56.79,92.2 58.32,93.73 DIS4.10 | 42.77,92.2 56.79,92.2 | 70.82,92.2 72.34,93.73 DIS5.10 | 56.79,92.2 70.82,92.2 | 83.31,92.2 DIS6.10 | 70.82,92.2 83.31,92.2 | 83.31,92.2 96.11,92.2 97.64,93.73 DIS7.10
N$41  (via drill 0.61)
  Top 0.305: DIS6.5 93.37,80.62 91.54,80.62 91.54,74.52 | 91.54,74.52 99.47,66.6 107.7,66.6 107.7,78.49 DIS7.5 | DIS2.5 43.08,77.57 43.08,62.94 44.91,62.94 46.74,64.77 IC5.22 | v36.07,65.68 36.07,71.78 29.36,78.49 DIS1.5 | DIS3.5 53.75,77.88 53.75,66.29 53.14,65.68 v53.14,62.94 | v68.07,70.26 68.07,78.18 68.38,78.49 DIS4.5 | v78.13,74.22 82.4,78.49 DIS5.5 | v90.93,74.52 91.54,74.52
  Bottom 0.305: v36.07,65.68 38.81,62.94 44.91,62.94 | 44.91,62.94 46.74,64.77 IC5.22 | 44.91,62.94 v53.14,62.94 63.5,62.94 63.5,65.68 v68.07,70.26 74.17,70.26 v78.13,74.22 90.63,74.22 v90.93,74.52
N$42
  Top 0.305: DIS1.8 24.18,93.73 24.18,78.79 DIS1.3 24.18,78.49 33.02,69.65 33.02,61.72 39.73,61.72 44.3,57.15 IC5.2
N$43
  Top 0.305: DIS2.8 36.98,93.73 36.98,78.79 DIS2.3 36.98,78.49 36.98,62.33 46.74,62.33 50.7,58.37 50.7,55.32 57.71,55.32 58.32,55.93 58.32,59.59 66.55,59.59 66.85,59.28 66.85,57.45 67.16,57.15 IC5.11
N$44
  Top 0.305: DIS3.8 49.78,93.73 49.78,78.79 DIS3.3 50.7,77.57 50.7,60.81 54.36,57.15 IC5.6
N$45
  Top 0.305: IC5.7 57.4,57.15 57.71,57.45 57.71,60.5 61.06,63.86 61.06,76.05 63.5,78.49 DIS4.3 DIS4.8
N$46  (via drill 0.61)
  Top 0.305: v68.07,60.81 77.22,69.95 77.22,78.49 DIS5.3 77.52,78.79 77.52,93.73 DIS5.8
  Bottom 0.305: v68.07,60.81 50.7,60.81 47.04,57.15 IC5.3
N$47
  Top 0.305: IC5.10 65.02,57.15 65.63,56.54 65.63,55.63 66.55,54.71 90.02,54.71 90.02,78.49 DIS6.3 90.32,78.79 90.32,93.73 DIS6.8
N$48  (via drill 0.61)
  Top 0.305: v101.6,68.12 102.82,69.34 102.82,78.49 DIS7.3 103.12,78.79 103.12,93.73 DIS7.8
  Bottom 0.305: v101.6,68.12 100.38,68.12 87.58,55.32 54.05,55.32 52.22,57.15 IC5.5
N$49
  Bottom 0.305: LED9.K 100.38,71.17 112.88,71.17 R21.2
N$50
  Bottom 0.305: IC5.18 57.4,64.77 57.4,68.43 59.54,68.43 R20.2
N$51
  Top 0.305: R2.2 13.82,74.22 11.99,76.05 11.99,76.66 10.16,78.49 IC3.6
  Bottom 0.305: IC3.6 10.16,78.79 11.99,80.62 11.99,90.37 11.68,90.37 U$1.PIN2
N$52
  Bottom 0.305: U$2.6 118.97,74.22 120.8,72.39 121.11,72.39 121.72,71.78 121.72,69.95 101.6,69.95 LED9.A
N$53
  Top 0.305: IC2.10 44.6,42.21 44.6,42.82 56.49,54.71 61.06,54.71 61.06,58.37 61.67,58.98 66.24,58.98 66.24,55.93 66.85,55.32 69.6,55.32 69.6,57.15 IC5.12
N$55
  Bottom 0.305: U$2.15 118.67,52.58 115.62,55.63 101.6,55.63 LED10.A
N$56
  Top 0.305: R22.2 99.16,57.15 99.16,55.93 LED10.K
N$57
  Top 0.305: X1.6 121.41,30.02 118.97,30.02 118.97,35.51 120.5,37.03 121.41,37.03 X1.3
N$59  (via drill 0.61)
  Top 0.305: v47.04,29.41 47.04,26.67 IC2.42 | 101.3,39.47 100.38,40.39 R23.1 | 101.3,39.47 101.6,39.17 101.6,17.83 106.48,17.83 R27.1 | 101.3,39.47 101.3,42.21 121.41,42.21 X1.1
  Bottom 0.305: v47.04,29.41 81.79,29.41 91.85,39.47 99.16,39.47 R23.1
N$60  (via drill 0.61)
  Top 0.305: IC2.12 42.77,42.21 v42.77,43.43 42.77,44.35 40.64,46.48 40.64,55.93 41.86,57.15 IC5.1 | R24.1 100.08,38.25 99.16,39.17 99.16,41 101.6,43.43 124.46,43.43 124.46,41.6 122.63,39.78 121.72,39.78 X1.2
  Bottom 0.305: v42.77,43.43 44.3,41.91 100.69,41.91 101.6,41 101.6,38.25 100.38,38.25 R24.1
N$62  (via drill 0.61)
  Top 0.305: v45.21,29.72 42.16,32.77 42.16,41.91 IC2.13 | X1.7 121.41,26.98 107.7,26.98 107.7,17.22 107.09,16.61 100.38,16.61 100.38,27.89 R26.1
  Bottom 0.305: v45.21,29.72 46.43,28.5 47.65,28.5 47.95,28.8 91.85,28.8 92.15,29.11 99.16,29.11 R26.1
N$63
  Bottom 0.305: R27.2 114.4,17.53 115.32,16.61 118.06,16.61 LED11.K
PE  (via drill 0.61)
  Top 0.305: 120.8,58.37 120.8,70.87 R21.1 120.8,71.17 122.94,71.17 C12.2 | 120.8,58.37 120.8,57.15 R22.1 | R25.2 92.46,31.85 85.14,39.17 85.14,45.57 SD.- 84.84,45.87 61.98,45.87 | v55.27,30.94 55.27,31.55 53.75,31.55 IC2.53 | 59.54,39.47 53.75,39.47 IC2.63 | 59.54,39.47 59.54,38.25 C9.2 60.76,37.03 60.76,31.55 C8.2 | 30.28,58.06 27.84,58.06 IC1.13 | 30.28,58.06 30.28,51.05 C6.2 | 30.28,58.06 30.28,58.67 33.02,58.67 IC1.5 | IC5.4 49.48,57.15 43.08,50.75 43.08,48.92 42.16,48.01 42.16,47.09 JP2.6 | 59.54,39.47 61.98,41.91 61.98,45.87 | 61.98,45.87 61.98,57.15 IC5.9 | 120.8,58.37 92.76,58.37 92.76,48.31 C13.1 | U$1.PIN3 8.64,93.42 8.64,90.68 U$1.PIN4 8.64,90.37 8.64,85.5 10.16,83.97 IC3.8 10.16,83.67 5.28,78.79 5.28,78.49 | 5.28,78.49 2.54,81.23 IC3.2 | 5.28,78.49 11.38,72.39 C5.2 | IC4.GND 6.5,19.05 9.25,21.79 9.25,29.41 J2.GNDBREAK 9.25,29.72 9.25,31.55 6.5,34.29 | 22.96,68.73 22.96,69.65 C4.2 | 22.96,68.73 22.96,64.77 C3.2 22.66,64.77 22.66,56.84 21.74,55.93 C11.2 21.44,55.63 21.44,51.97 20.52,51.05 C7.2 20.22,50.75 14.12,44.65 14.12,44.35 | 22.96,68.73 29.06,68.73 C10.- | v39.42,36.42 38.2,36.42 IC2.22 | C1.1 26.62,34.29 26.62,36.73 C2.1 | 17.78,40.69 15.34,43.13 | 15.34,43.13 14.12,44.35 | 14.12,44.35 10.77,47.7 10.77,56.54 9.25,58.06 CN1.GND | 17.78,40.69 20.22,40.69 DC_IN2.2 | 17.78,40.69 DC_OUT.2 | 15.34,43.13 6.5,34.29 | 6.5,34.29 J2.GND | ADC0_TERMINAL.1 132.08,9.91 126.59,4.42 126.59,3.2 125.68,2.29 118.36,2.29 118.36,3.81 ADC1_TERMINAL.1 118.06,3.81 118.06,5.64 107.39,5.64 105.56,3.81 ADC2_TERMINAL.1 101.3,3.81 101.3,3.2 100.38,2.29 92.76,2.29 92.76,3.81 ADC3_TERMINAL.1
  Top 0.305: INT5_TERMINAL.1 15.34,3.81 16.26,4.72 16.26,9.91 DC_IN.- | 28.14,12.95 31.5,12.95 LED2.K | 28.14,12.95 26.92,12.95 LED1.K | 28.14,12.95 28.14,3.81 INT6_TERMINAL.1 | LED3.K 36.98,12.95 41.86,12.95 LED4.K | LED4.K 42.16,12.95 46.74,12.95 LED5.K 47.04,12.95 51.92,12.95 LED6.K 52.22,12.95 54.66,12.95 | ADC7_TERMINAL.1 41.86,3.81 41.86,12.65 LED4.K | 54.66,12.95 57.1,12.95 LED7.K 57.4,12.95 61.98,12.95 LED8.K 62.28,12.65 62.28,8.69 67.16,3.81 ADC5_TERMINAL.1 | 54.66,12.95 54.66,3.81 ADC6_TERMINAL.1
  Bottom 0.305: U$2.10 110.74,74.22 112.57,72.39 119.28,72.39 120.5,71.17 R21.1 | C13.1 90.32,45.87 85.14,45.87 SD.- | v55.27,30.94 55.57,30.63 59.54,30.63 C8.2 | IC5.9 61.98,57.15 60.15,58.98 51.61,58.98 49.78,57.15 IC5.4 | JP2.6 41.86,47.09 34.24,47.09 30.58,50.75 C6.2 30.28,51.05 29.36,51.97 21.44,51.97 20.52,51.05 C7.2 | v39.42,36.42 39.12,36.73 26.92,36.73 C2.1 26.62,37.03 23.27,40.39 20.52,40.39 DC_IN2.2 | C5.2 11.68,72.39 12.6,71.48 21.13,71.48 22.66,69.95 C4.2 | LED1.K 24.18,10.21 16.56,10.21 DC_IN.- 16.26,10.21 15.34,10.21 6.5,19.05 IC4.GND | ADC3_TERMINAL.1 92.46,3.81 90.93,5.33 81.79,5.33 80.26,3.81 ADC4_TERMINAL.1 79.96,3.81 78.44,5.33 68.99,5.33 67.46,3.81 ADC5_TERMINAL.1 | LED2.K 31.8,12.65 36.68,12.65 LED3.K
RESET  (via drill 0.61)
  Top 0.305: v36.07,48.01 36.07,37.95 37.9,37.95 IC2.20
  Bottom 0.305: v36.07,48.01 37.59,49.53 JP2.5
RXCAN  (via drill 0.61)
  Top 0.305: v27.84,53.49 27.84,29.11 37.9,29.11 IC2.31
  Bottom 0.305: v27.84,53.49 22.05,59.28 16.87,59.28 2.54,73.61 IC3.4
RXD1  (via drill 0.61)
  Top 0.305: v36.98,42.21 36.98,58.06 33.33,58.06 IC1.4 | v40.64,38.56 41.25,37.95 41.25,34.9 38.51,32.16 38.2,32.16 IC2.27
  Bottom 0.305: v40.64,38.56 v36.98,42.21
SCK  (via drill 0.61)
  Top 0.305: v124.16,28.5 124.46,28.8 124.46,30.33 122.63,32.16 121.72,32.16 X1.5 | IC2.11 43.69,42.21 43.69,45.87 43.08,46.48 43.08,48.01 44.3,49.22 44.3,49.53 JP2.3 | v90.93,60.2 90.93,48.31 93.98,45.26 93.98,37.95 100.08,31.85 R25.1
  Bottom 0.305: v124.16,28.5 103.43,28.5 100.38,31.55 R25.1 | JP2.3 45.52,49.53 45.52,58.06 48.87,61.42 66.24,61.42 69.6,64.77 IC5.13 86.36,64.77 v90.93,60.2
TXCAN  (via drill 0.61)
  Top 0.305: v34.24,48.62 34.24,30.02 37.9,30.02 IC2.30
  Bottom 0.305: v34.24,48.62 22.96,59.89 17.17,59.89 4.37,72.69 4.37,83.67 2.54,83.67 IC3.1
TXD1
  Top 0.305: IC1.1 33.33,56.24 35.15,54.41 35.15,33.38 36.98,31.55 37.9,31.55 IC2.28
VCC  (via drill 0.61)
  Top 0.305: C12.1 128.42,71.17 128.42,74.22 U$2.1 | DC_IN.+ 16.56,25.45 16.56,26.67 22.66,32.77 ENSRET.C 22.66,33.07 22.66,33.38 20.52,35.51 DC_IN2.1 20.52,35.81 24.18,39.47 24.18,63.86 v27.53,67.21
  Bottom 0.305: U$2.1 128.42,74.52 127.2,75.74 122.02,75.74 120.8,74.52 U$2.5 120.5,74.52 118.67,76.35 38.81,76.35 29.67,67.21 v27.53,67.21 | IC4.IN 8.94,19.05 15.04,25.15 16.26,25.15 DC_IN.+